# EAGLE design mintytime (EAGLE 5.08)
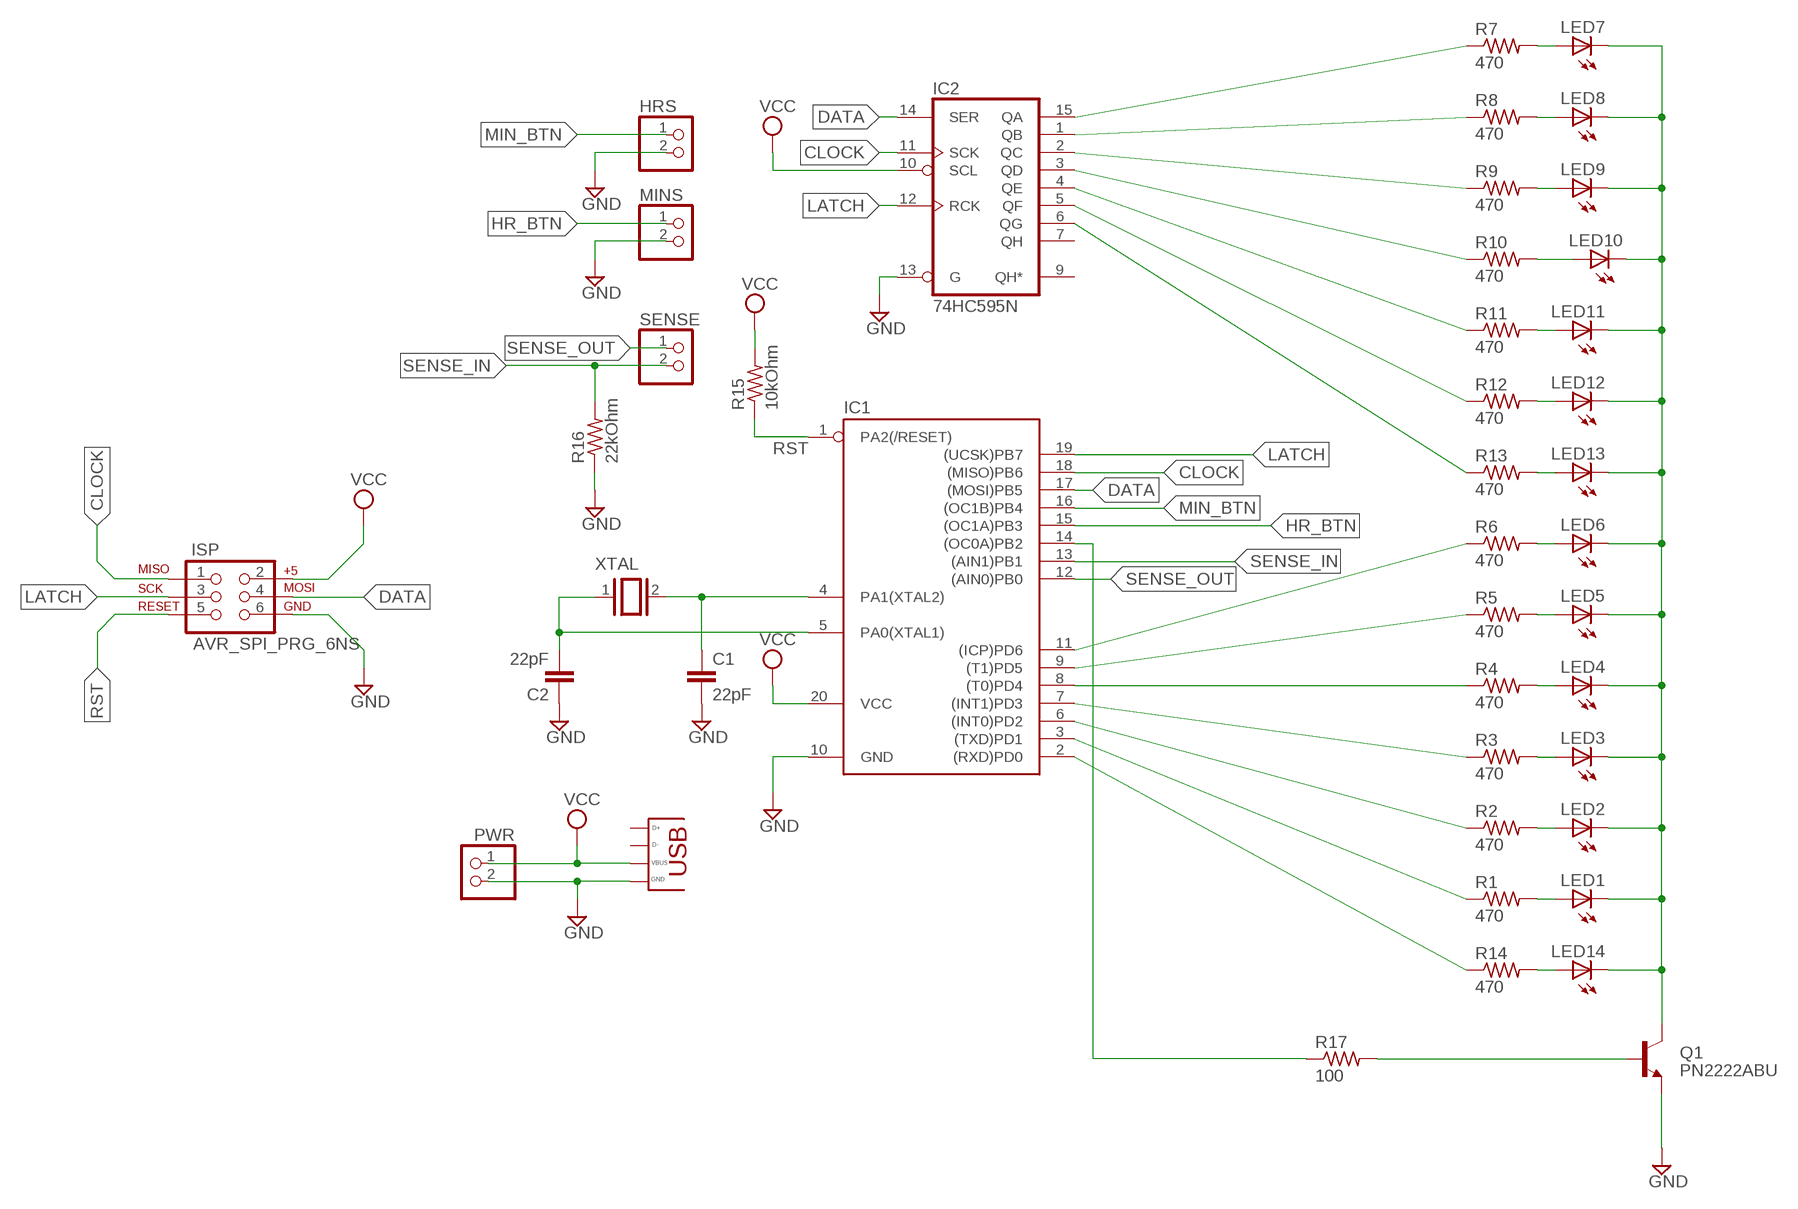
[diagram p0: schematic, sheet 1]

## Parts
C1  22pF  CAPPTH2  [CAP-PTH-SMALL2]
C2  22pF  CAPPTH2  [CAP-PTH-SMALL2]
HRS  PINHD-1X2  [1X02]
IC1  TINY2313-*P*  [DIL20]
IC2  74HC595N  [DIL16]
ISP  AVR_SPI_PRG_6NS  [2X3-NS]
LED1  LED3MM  [LED3MM]
LED2  LED3MM  [LED3MM]
LED3  LED3MM  [LED3MM]
LED4  LED3MM  [LED3MM]
LED5  LED3MM  [LED3MM]
LED6  LED3MM  [LED3MM]
LED7  LED3MM  [LED3MM]
LED8  LED3MM  [LED3MM]
LED9  LED3MM  [LED3MM]
LED10  LED3MM  [LED3MM]
LED11  LED3MM  [LED3MM]
LED12  LED3MM  [LED3MM]
LED13  LED3MM  [LED3MM]
LED14  LED3MM  [LED3MM]
MINS  PINHD-1X2  [1X02]
PWR  PINHD-1X2  [1X02]
Q1  PN2222ABU  2N3904EZ  [TO92-EZ]
R1  470  R-US_0204/7  [0204/7]
R2  470  R-US_0204/7  [0204/7]
R3  470  R-US_0204/7  [0204/7]
R4  470  R-US_0204/7  [0204/7]
R5  470  R-US_0204/7  [0204/7]
R6  470  R-US_0204/7  [0204/7]
R7  470  R-US_0204/7  [0204/7]
R8  470  R-US_0204/7  [0204/7]
R9  470  R-US_0204/7  [0204/7]
R10  470  R-US_0204/7  [0204/7]
R11  470  R-US_0204/7  [0204/7]
R12  470  R-US_0204/7  [0204/7]
R13  470  R-US_0204/7  [0204/7]
R14  470  R-US_0204/7  [0204/7]
R15  10kOhm  R-US_0204/7  [0204/7]
R16  22kOhm  R-US_0204/7  [0204/7]
R17  100  R-US_0204/7  [0204/7]
SENSE  PINHD-1X2  [1X02]
U$1  MICRO-USB-POWERWUSB  [WUSB]
XTAL  XTAL  [Q]

## Nets
CLOCK: IC1.18((MISO)PB6) IC2.11(SCK) ISP.1
DATA: IC1.17((MOSI)PB5) IC2.14(SER) ISP.4
GND: C1.2 C2.1 HRS.2 IC1.10(GND) IC2.13(G) ISP.6 MINS.2 PWR.2 Q1.3(E) R16.1 U$1.GND
HR_BTN: IC1.15((OC1A)PB3) MINS.1
LATCH: IC1.19((UCSK)PB7) IC2.12(RCK) ISP.3
LED_GND: LED1.K(C) LED2.K(C) LED3.K(C) LED4.K(C) LED5.K(C) LED6.K(C) LED7.K(C) LED8.K(C) LED9.K(C) LED10.K(C) LED11.K(C) LED12.K(C) LED13.K(C) LED14.K(C) Q1.1(C)
MIN_BTN: HRS.1 IC1.16((OC1B)PB4)
N$1: C1.1 IC1.4(PA1(XTAL2)) XTAL.2
N$2: C2.2 IC1.5(PA0(XTAL1)) XTAL.1
N$3: LED1.A R1.2
N$4: LED2.A R2.2
N$5: LED3.A R3.2
N$6: LED4.A R4.2
N$7: LED5.A R5.2
N$8: LED6.A R6.2
N$9: LED7.A R7.2
N$10: LED8.A R8.2
N$11: LED9.A R9.2
N$12: LED10.A R10.2
N$13: LED11.A R11.2
N$14: LED12.A R12.2
N$15: LED13.A R13.2
N$16: LED14.A R14.2
N$17: IC1.2((RXD)PD0) R14.1
N$18: Q1.2(B) R17.2
N$19: IC1.14((OC0A)PB2) R17.1
N$27: IC1.3((TXD)PD1) R1.1
N$28: IC1.6((INT0)PD2) R2.1
N$29: IC1.7((INT1)PD3) R3.1
N$30: IC1.8((T0)PD4) R4.1
N$31: IC1.9((T1)PD5) R5.1
N$32: IC1.11((ICP)PD6) R6.1
N$38: IC2.15(QA) R7.1
N$39: IC2.1(QB) R8.1
N$40: IC2.2(QC) R9.1
N$41: IC2.3(QD) R10.1
N$42: IC2.4(QE) R11.1
N$43: IC2.5(QF) R12.1
N$44: IC2.6(QG) R13.1
RST: IC1.1(PA2(/RESET)) ISP.5 R15.1
SENSE_IN: IC1.13((AIN1)PB1) R16.2 SENSE.2
SENSE_OUT: IC1.12((AIN0)PB0) SENSE.1
VCC: IC1.20(VCC) IC2.10(SCL) ISP.2 PWR.1 R15.2 U$1.5V(VBUS)
Unconnected: IC2.7(QH) IC2.9(QH*) U$1.D+ U$1.D-

## Power pins joined to a net without a drawn wire
GND: IC2.8(GND)
VCC: IC2.16(VCC)

## Library data of the parts
C1 C2 = SparkFun:CAP: Capacitor Standard 0603 ceramic capacitor, and 0.1" leaded capacitor.
HRS MINS PWR SENSE = pinhead:PINHD-1X2: PIN HEADER
IC1 = avr-6:TINY2313*: Atmel Tiny2313 2K Flash, 128 bytes EEPROM, 128 bytes RAM
IC2 = 74xx-eu:74*595: 8-bit SHIFT REGISTER, output latch
ISP = SparkFun:AVR_SPI_PRG_6: AVR ISP 6 Pin This is the reduced ISP connector for AVR programming. Common on Arduino. This footprint will take up less PCB space and can be used with a 10-pin to 6-pin adapter such as SKU: BOB-08508
LED1-LED14 = led:LED: LED OSRAM: - CHIPLED LG R971, LG N971, LY N971, LG Q971, LY Q971, LO R971, LY R971 LH N974, LH R974 LS Q976, LO Q976, LY Q976 LO Q996 - Hyper CHIPLED LW Q18S LB Q993, LB Q99A, LB R99A - SideLED LS A670, LO A670, LY A670, LG A670, LP A670 LB A673, LV A673, LT A673, LW A673 LH A674 LY A675 LS A676, LA A676, LO A676, LY A676, LW A676 LS A679, LY A679, LG A679 - Hyper Micro SIDELED® LS Y876, LA Y876, LO Y876, LY Y876 LT Y87S - SmartLED LW L88C, LW L88S LB L89C, LB L89S, LG L890 LS L89K, LO L89K, LY L89K LS L896, LA L896, LO L896, LY L896 - TOPLED LS T670, LO T670, LY T670, LG T670, LP T670 LSG T670, LSP T670, LSY T670, LOP T670, LYG T670 LG T671, LOG T671, LSG T671 LB T673, LV T673, LT T673, LW T673 LH T674 LS T676, LA T676, LO T676, LY T676, LB T676, LH T676, LSB T676, LW T676 LB T67C, LV T67C, LT T67C, LS T67K, LO T67K, LY T67K, LW E67C LS E67B, LA E67B, LO E67B, LY E67B, LB E67C, LV E67C, LT E67C LW T67C LS T679, LY T679, LG T679 LS T770, LO T770, LY T770, LG T770, LP T770 LB T773, LV T773, LT T773, LW T773 LH T774 LS E675, LA E675, LY E675, LS T675 LS T776, LA T776, LO T776, LY T776, LB T776 LHGB T686 LT T68C, LB T68C - Hyper Mini TOPLED® LB M676 - Mini TOPLED Santana® LG M470 LS M47K, LO M47K, LY M47K Source: http://www.osram.convergy.de LUXEON: - LUMILED® LXK2-PW12-R00, LXK2-PW12-S00, LXK2-PW14-U00, LXK2-PW14-V00 LXK2-PM12-R00, LXK2-PM12-S00, LXK2-PM14-U00 LXK2-PE12-Q00, LXK2-PE12-R00, LXK2-PE12-S00, LXK2-PE14-T00, LXK2-PE14-U00 LXK2-PB12-K00, LXK2-PB12-L00, LXK2-PB12-M00, LXK2-PB14-N00, LXK2-PB14-P00, LXK2-PB14-Q00 LXK2-PR12-L00, LXK2-PR12-M00, LXK2-PR14-Q00, LXK2-PR14-R00 LXK2-PD12-Q00, LXK2-PD12-R00, LXK2-PD12-S00 LXK2-PH12-R00, LXK2-PH12-S00 LXK2-PL12-P00, LXK2-PL12-Q00, LXK2-PL12-R00 Source: www.luxeon.com KINGBRIGHT: KA-3528ASYC Source: www.kingbright.com
Q1 = transistor-npn:2N3904: NPN Transistor
R1-R17 = resistor:R-US_: RESISTOR, American symbol
U$1 = wicked-device:MICRO-USB-POWER
XTAL = special:XTAL: CRYSTAL

## Board
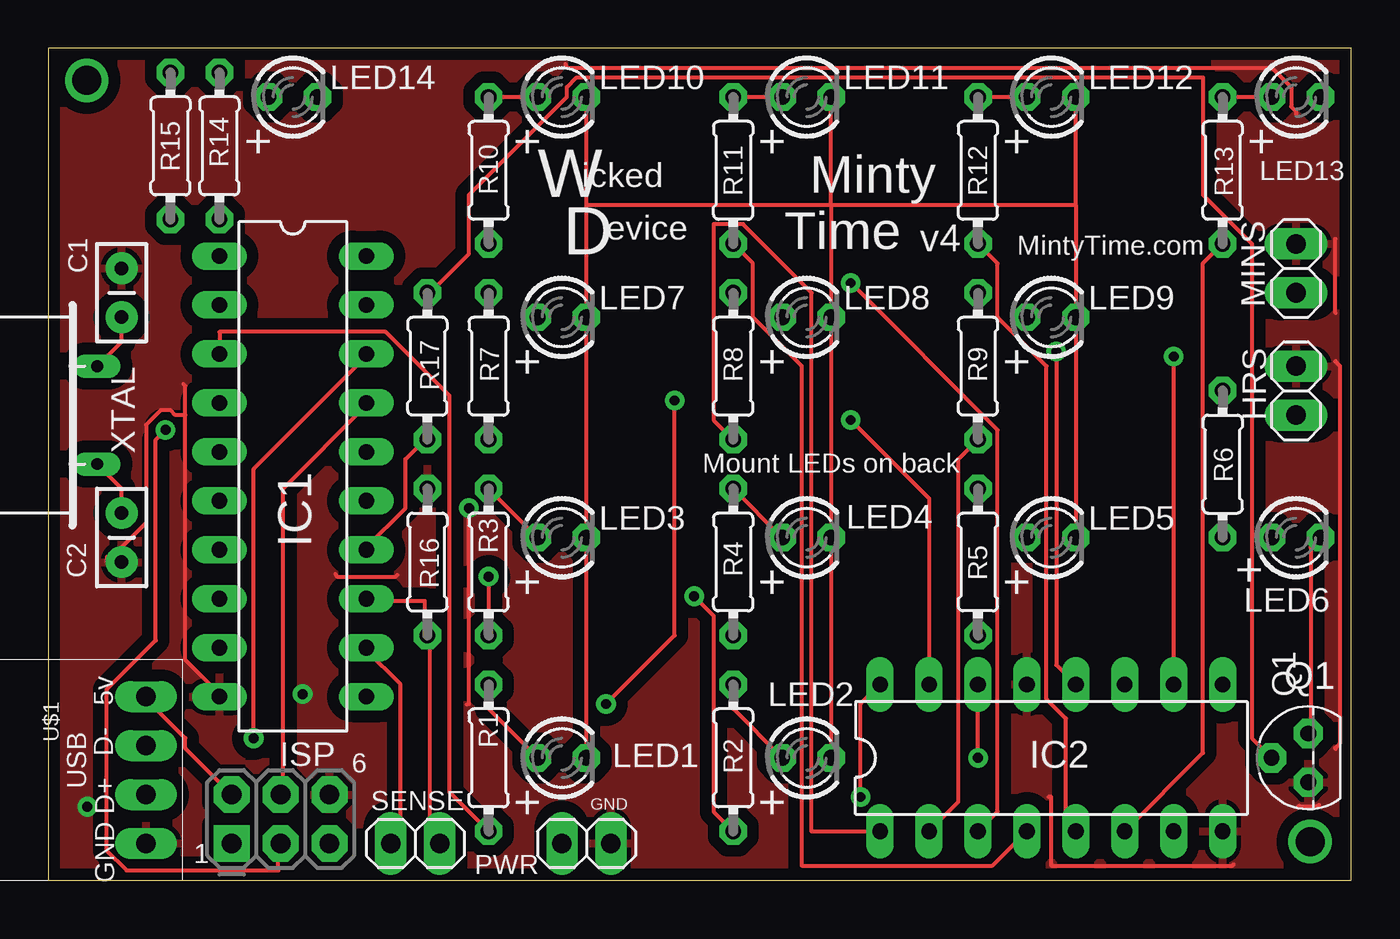
[diagram p1: board, top side]
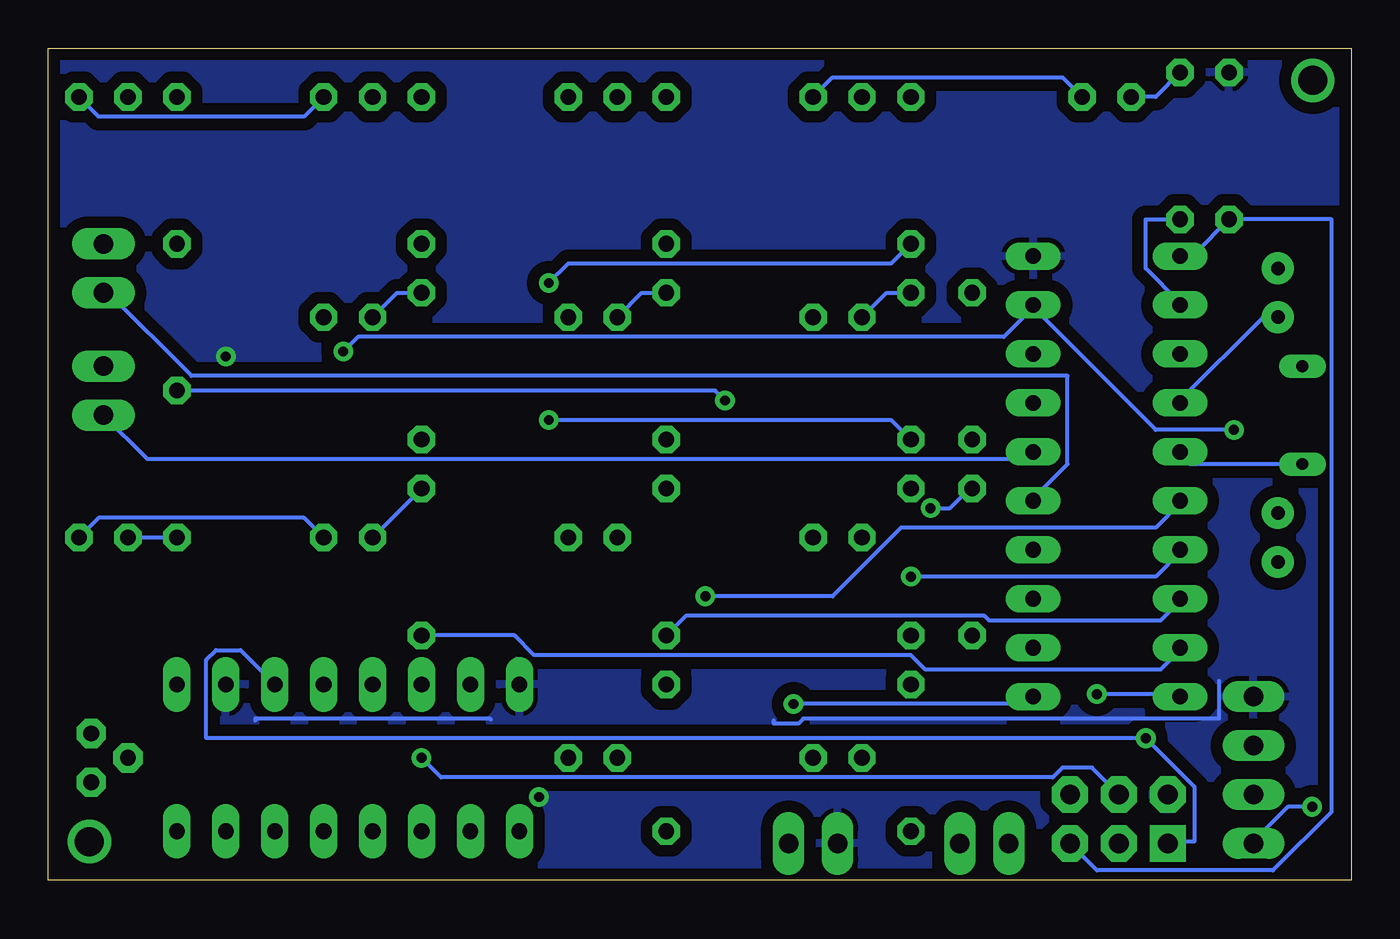
[diagram p2: board, bottom side, seen from below]

Size 67.64 x 43.17 mm. Coordinates in mm from the lower left corner, seen from the top.
Outline: 0,0 67.64,0 67.64,43.17 0,43.17 0,0
Copper layers (1*16): Top 0.035mm / dielectric 1.5mm / Bottom 0.035mm
Design rules "SparkFun *": minimum track width 8mil, minimum drill 20mil, track to track 8mil, track to pad 8mil, pad to pad 8mil, via to via 8mil, smd to smd 8mil, copper to edge 16mil, drill to drill 8mil, minimum pad ring 12mil, minimum via ring 10mil, stop-mask expansion 4mil, vias tented up to drill 25mil, thermal gap 10mil

### Footprints (pad centres in the part's own frame; a part is rotated, then mirrored left to right if it is on the bottom)
CAP-PTH-SMALL2 = drill 0.7 pad 1.651 round: 1 0,0; 2 2.54,0
1X02 = drill 1.016 long: 1 -1.27,0; 2 1.27,0
DIL20 = drill 0.813 long: 1 -11.43,-3.81; 2 -8.89,-3.81; 3 -6.35,-3.81; 4 -3.81,-3.81; 5 -1.27,-3.81; 6 1.27,-3.81; 7 3.81,-3.81; 8 6.35,-3.81; 9 8.89,-3.81; 10 11.43,-3.81; 11 11.43,3.81; 12 8.89,3.81; 13 6.35,3.81; 14 3.81,3.81; 15 1.27,3.81; 16 -1.27,3.81; 17 -3.81,3.81; 18 -6.35,3.81; 19 -8.89,3.81; 20 -11.43,3.81
DIL16 = drill 0.813 long: 1 -8.89,-3.81; 2 -6.35,-3.81; 3 -3.81,-3.81; 4 -1.27,-3.81; 5 1.27,-3.81; 6 3.81,-3.81; 7 6.35,-3.81; 8 8.89,-3.81; 9 8.89,3.81; 10 6.35,3.81; 11 3.81,3.81; 12 1.27,3.81; 13 -1.27,3.81; 14 -3.81,3.81; 15 -6.35,3.81; 16 -8.89,3.81
2X3-NS = drill 1.016 pad 1.88 square: 1 -2.54,-1.27 | drill 1.016 pad 1.88 octagon: 2 -2.54,1.27; 3 0,-1.27; 4 0,1.27; 5 2.54,-1.27; 6 2.54,1.27
LED3MM = drill 0.813 octagon: A -1.27,0; K 1.27,0
TO92-EZ = drill 0.813 pad 1.524 octagon: 1 1.27,0; 2 0,1.905; 3 -1.27,0
0204/7 = drill 0.813 octagon: 1 -3.81,0; 2 3.81,0
WUSB = drill 1 long: 5V -3.81,0; D+ 1.27,0; D- -1.27,0; GND 3.81,0
Q = drill 0.61 long: 1 -2.54,-7.62; 2 2.54,-7.62

### Placement (x,y rotation side)
C1  3.81,29.21 90 top
C2  3.81,16.51 90 top
HRS  64.77,25.4 90 top
IC1  12.7,20.95 270 top
IC2  52.07,6.35 0 top
ISP  12.06,3.17 0 top
LED1  26.67,6.35 0 top
LED2  39.37,6.35 0 top
LED3  26.67,17.78 0 top
LED4  39.37,17.78 0 top
LED5  52.07,17.78 0 top
LED6  64.77,17.78 0 top
LED7  26.67,29.21 0 top
LED8  39.37,29.21 0 top
LED9  52.07,29.21 0 top
LED10  26.67,40.64 0 top
LED11  39.37,40.64 0 top
LED12  52.07,40.64 0 top
LED13  64.77,40.64 0 top
LED14  12.7,40.64 0 top
MINS  64.77,31.75 90 top
PWR  27.94,1.91 0 top
Q1  65.41,6.35 90 top
R1  22.86,6.35 90 top
R2  35.56,6.35 90 top
R3  22.86,16.51 90 top
R4  35.56,16.51 90 top
R5  48.26,16.51 90 top
R6  60.96,21.59 270 top
R7  22.86,26.67 90 top
R8  35.56,26.67 90 top
R9  48.26,26.67 90 top
R10  22.86,36.83 90 top
R11  35.56,36.83 90 top
R12  48.26,36.83 90 top
R13  60.96,36.83 90 top
R14  8.89,38.1 90 top
R15  6.35,38.1 90 top
R16  19.68,16.51 270 top
R17  19.68,26.67 90 top
SENSE  19.05,1.91 0 top
U$1  5.08,5.71 270 top
XTAL  -5.08,24.13 90 top

### Tracks (layer width: path | path; a pad name or v marks a point on that pad's centre or on a via)
CLOCK  (via drill 0.51)
  Top 0.203: v10.67,7.37 10.67,21.34 16.51,27.18 IC1.18
  Bottom 0.203: ISP.1 9.4,2.03 8.13,2.03 8.13,4.83 v10.67,7.37 59.44,7.37 59.44,11.43 58.93,11.94 57.66,11.94 IC2.11
DATA  (via drill 0.51)
  Top 0.203: IC1.17 16.51,24.64 12.19,20.32 12.19,4.57 ISP.4 | v48.26,6.35 IC2.14
  Bottom 0.203: v48.26,6.35 47.24,5.33 15.49,5.33 14.99,5.84 13.46,5.84 ISP.4
GND  (via drill 0.51)
  Top 0.203: 18.13,15.85 18.03,15.75 14.99,15.75 14.91,15.88 | 64.9,3.86 65.02,3.81 65.79,3.81 65.96,3.91 | 61.54,0.81 61.47,0.76 52.07,0.76 52.07,4.32 51.92,4.32 | 66.83,6.82 66.8,6.86 67.06,7.11 67.06,26.67 66.8,26.92 66.83,26.93 | 66.83,29.43 66.8,29.46 66.8,33.27 66.83,33.28 | 64.77,39.76 64.77,39.88 64.52,40.13 64.52,41.15 63.5,42.16 26.92,42.16 26.84,42.36 | 7.11,24.13 7.11,25.65 7.01,25.75 | 7.11,24.13 7.11,11.43 8.89,9.65 IC1.10 | 7.11,24.13 6.6,24.13 6.35,24.38 5.84,24.38 5.08,23.62 5.08,18.54 3.3,16.76 3.05,16.76 3.05,16.51 C2.1 | v21.84,19.3 21.84,9.14 21.74,9.12
  Bottom 0.203: v13.21,9.65 8.89,9.65 IC1.10 | v21.84,19.3 20.83,19.3 19.81,20.32 R16.1 | v2.03,3.81 3.3,3.81 5.08,2.03 U$1.GND
  pour Top (isolate 0.61): 0,43.18 67.31,43.18 67.31,0 0,0 0,42.55
HR_BTN
  Bottom 0.203: MINS.1 64.52,30.48 60.2,26.16 14.73,26.16 14.73,21.59 16.51,19.81 IC1.15
LATCH  (via drill 0.51)
  Top 0.203: v6.1,23.37 5.59,22.86 5.59,12.45 3.05,9.91 3.05,1.52 4.06,0.51 11.94,0.51 11.94,1.78 ISP.3 | IC2.12 52.32,11.18 v52.32,27.43
  Bottom 0.203: 16.51,29.72 10.16,23.37 v6.1,23.37 | v52.32,27.43 51.56,28.19 18.03,28.19 16.51,29.72 | 16.51,29.72 IC1.19
LED_GND
  Top 0.203: LED6.K 65.53,17.27 65.53,7.62 Q1.1 | LED5.K LED9.K 53.34,35.05 | 53.34,35.05 LED12.K | LED2.K LED4.K LED8.K 40.64,35.05 | 40.64,35.05 LED11.K | LED1.K LED3.K LED7.K 27.94,35.05 | 27.94,35.05 LED10.K | 27.94,35.05 40.64,35.05 | 40.64,35.05 53.34,35.05
  Bottom 0.203: LED13.K 65.02,39.62 54.36,39.62 LED12.K | LED6.K 65.02,18.8 54.36,18.8 LED5.K | LED14.K 14.99,41.66 26.92,41.66 LED10.K
MIN_BTN
  Bottom 0.203: HRS.1 62.48,21.84 16.76,21.84 16.51,22.1 IC1.16
N$1
  Top 0.203: XTAL.2 3.81,27.94 C1.1
  Bottom 0.203: C1.1 4.57,29.21 8.89,24.89 IC1.4
N$2
  Top 0.203: XTAL.1 3.81,20.32 C2.2
  Bottom 0.203: XTAL.1 8.38,21.59 8.89,22.1 IC1.5
N$3
  Top 0.203: LED1.A 22.86,8.89 R1.2
N$4
  Top 0.203: LED2.A 35.56,8.89 R2.2
N$5
  Top 0.203: LED3.A R3.2
N$6
  Top 0.203: LED4.A R4.2
N$7
  Bottom 0.203: LED5.A R5.2
N$8
  Bottom 0.203: R6.2 LED6.A
N$9
  Bottom 0.203: LED7.A 24.13,30.48 R7.2
N$10
  Bottom 0.203: LED8.A 36.83,30.48 R8.2
N$11
  Bottom 0.203: LED9.A 49.53,30.48 R9.2
N$12
  Top 0.203: R10.2 LED10.A
N$13
  Top 0.203: R11.2 LED11.A
N$14
  Top 0.203: R12.2 LED12.A
N$15
  Top 0.203: R13.2 LED13.A
N$16
  Bottom 0.203: R14.2 10.16,40.64 LED14.A
N$17
  Bottom 0.203: R14.1 10.67,34.29 10.67,31.75 8.89,29.97 IC1.2
N$18
  Top 0.203: Q1.2 62.48,7.37 62.48,33.02 59.94,35.56 59.94,41.66 27.43,41.66 26.92,41.15 26.92,40.64 21.84,35.56 21.84,32.51 19.81,30.48 R17.2
N$19
  Top 0.203: IC1.14 16.51,17.27 18.54,19.3 18.54,21.84 19.56,22.86 R17.1
N$20  (via drill 1.5)
  other vias: 2,41.5
N$21  (via drill 1.5)
  other vias: 65.5,2
N$27
  Top 0.203: R1.1 20.83,4.57 20.83,25.15 17.53,28.45 8.89,28.45 IC1.3
N$28  (via drill 0.51)
  Top 0.203: v33.53,14.73 34.54,13.72 34.54,3.56 R2.1
  Bottom 0.203: v33.53,14.73 26.92,14.73 23.37,18.29 10.16,18.29 8.89,19.56 IC1.6
N$29  (via drill 0.51)
  Top 0.203: v22.86,15.75 R3.1
  Bottom 0.203: v22.86,15.75 10.16,15.75 8.89,17.02 IC1.7
N$30
  Bottom 0.203: R4.1 34.54,13.72 19.05,13.72 18.8,13.46 9.91,13.46 8.89,14.48 IC1.8
N$31
  Bottom 0.203: R5.1 43.43,12.7 42.42,11.68 22.86,11.68 22.1,10.92 9.91,10.92 8.89,11.94 IC1.9
N$32  (via drill 0.51)
  Top 0.203: v28.96,9.14 32.51,12.7 v32.51,24.89
  Bottom 0.203: v28.96,9.14 16.76,9.14 16.51,9.4 IC1.11 | v32.51,24.89 33.02,25.4 R6.1
N$38  (via drill 0.51)
  Top 0.203: v41.66,23.88 45.72,19.81 IC2.15
  Bottom 0.203: R7.1 23.88,23.88 v41.66,23.88
N$39
  Top 0.203: IC2.1 39.62,2.54 39.62,30.48 36.07,34.04 34.54,34.04 34.54,23.88 R8.1
N$40
  Top 0.203: IC2.2 47.24,4.06 47.24,21.84 R9.1
N$41  (via drill 0.51)
  Top 0.203: IC2.3 49.28,3.56 49.28,23.37 v41.66,30.99
  Bottom 0.203: v41.66,30.99 40.64,32 23.88,32 R10.1
N$42
  Top 0.203: IC2.4 49.02,0.76 39.12,0.76 39.12,26.67 36.58,29.21 36.58,32 R11.1
N$43
  Top 0.203: IC2.5 52.83,3.05 52.83,8.38 51.82,9.4 51.82,26.67 49.28,29.21 49.28,32 R12.1
N$44
  Top 0.203: IC2.6 59.94,6.6 59.94,32 R13.1
RST
  Bottom 0.203: IC1.1 8.89,32.51 8.13,32.51 R15.1 1.02,34.29 1.02,3.56 4.06,0.51 13.21,0.51 ISP.5
SENSE_IN
  Top 0.203: IC1.13 16.51,14.48 19.56,14.48 19.56,12.7 R16.2 19.81,12.7 19.81,2.54 20.32,2.03 SENSE.2
SENSE_OUT
  Top 0.203: IC1.12 16.51,11.94 18.29,10.16 18.29,2.54 17.78,2.03 SENSE.1
VCC  (via drill 0.51)
  Top 0.203: ISP.2 7.11,6.86 7.11,7.37 5.08,9.4 U$1.5V | IC2.10 v58.42,27.18 | IC2.16 42.16,9.14 v42.16,4.32
  Bottom 0.203: 6.86,10.33 6.86,10.16 6.86,8.38 28.45,8.38 28.7,8.13 29.97,8.13 29.97,8.28 | 44.67,8.35 44.7,8.38 56.9,8.38 56.9,8.28 | v42.16,4.32 42.16,4.42
  pour Bottom (isolate 0.61): 0,43.18 67.31,43.18 67.31,0 0,0

### Text on the board
tPlace: Minty | + | + | + | + | + | icked | W | Time | v4 | evice | MintyTime.com | D | + | + | + | Mount LEDs on back | + | + | + | + | Q1 | 6 | USB | GND | + | + | 1 | PWR